# EAGLE schematic step_dance_wiring (EAGLE 9.6.2)
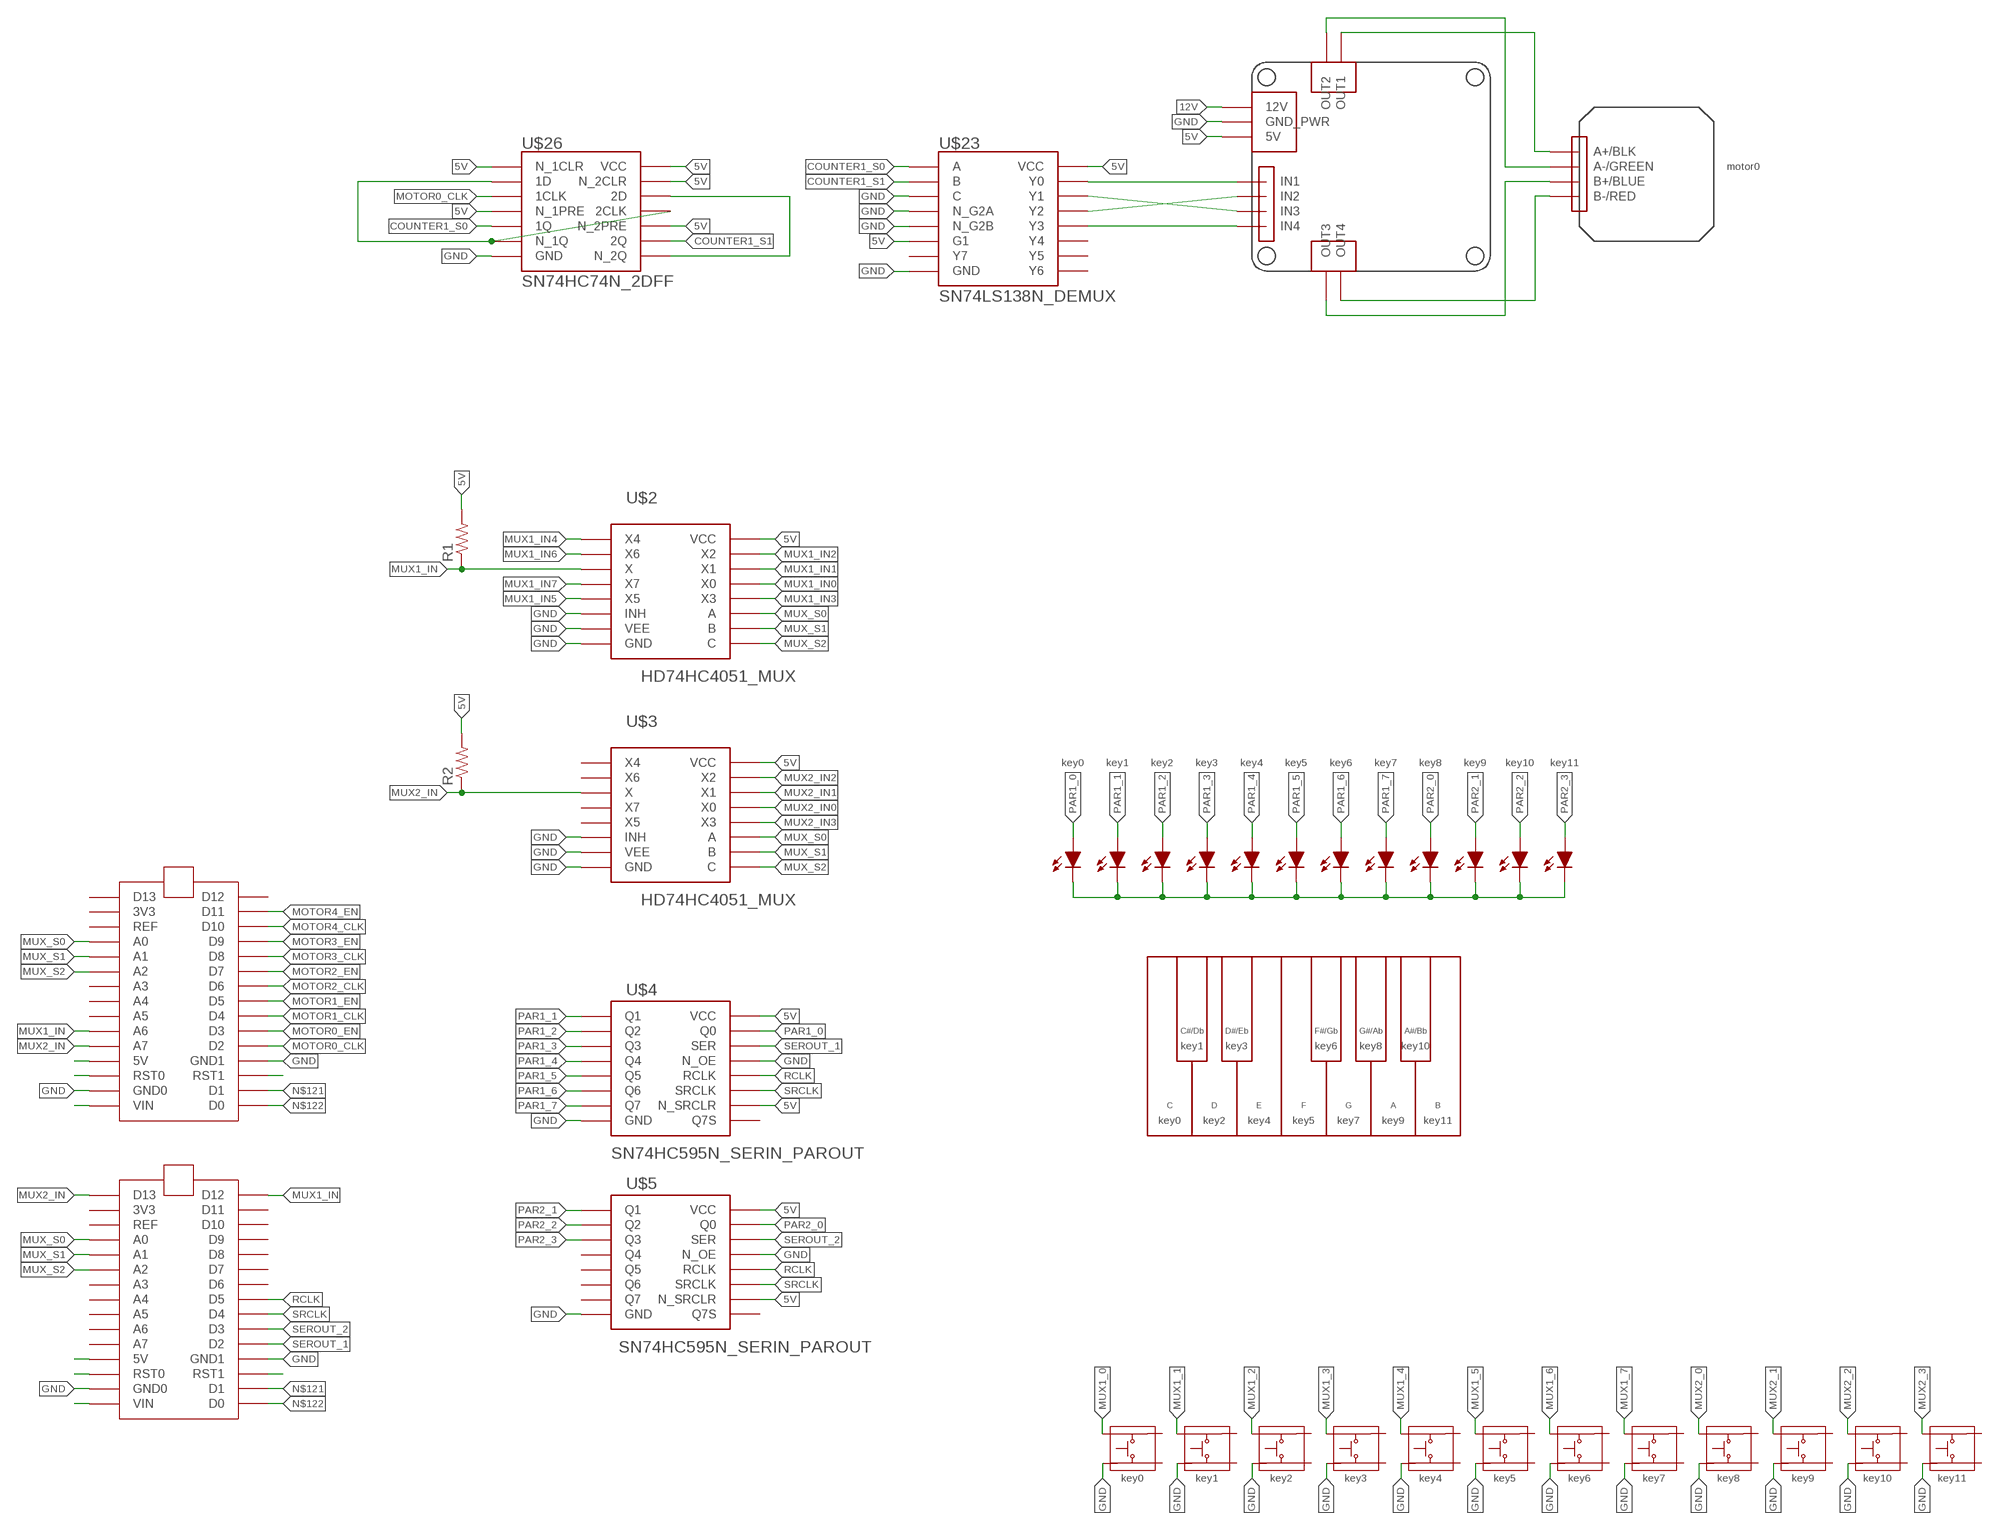
[diagram p0: schematic, sheet 1]

## Parts
LED1  LED-5MM  [LED-5MM]
LED2  LED-5MM  [LED-5MM]
LED3  LED-5MM  [LED-5MM]
LED4  LED-5MM  [LED-5MM]
LED5  LED-5MM  [LED-5MM]
LED6  LED-5MM  [LED-5MM]
LED7  LED-5MM  [LED-5MM]
LED8  LED-5MM  [LED-5MM]
LED9  LED-5MM  [LED-5MM]
LED10  LED-5MM  [LED-5MM]
LED11  LED-5MM  [LED-5MM]
LED12  LED-5MM  [LED-5MM]
R1  RES_AXIAL1/2W-0.5  [1/2W-0.5]
R2  RES_AXIAL1/2W-0.5  [1/2W-0.5]
U$1  ARDUNIO_NANO  [PINS]
U$2  HD74HC4051_MUX  [PINS]
U$3  HD74HC4051_MUX  [PINS]
U$4  SN74HC595N_SERIN_PAROUT  [PINS]
U$5  SN74HC595N_SERIN_PAROUT  [PINS]
U$7  MOTOR_DRIVER_HILETGO  [PINS]
U$8  STEPPER  [PINS]
U$9  KEYBOARD  [PINS]
U$10  PUSHBUTTON  [PINS]
U$11  PUSHBUTTON  [PINS]
U$12  PUSHBUTTON  [PINS]
U$13  PUSHBUTTON  [PINS]
U$14  PUSHBUTTON  [PINS]
U$15  PUSHBUTTON  [PINS]
U$16  PUSHBUTTON  [PINS]
U$17  PUSHBUTTON  [PINS]
U$18  PUSHBUTTON  [PINS]
U$19  PUSHBUTTON  [PINS]
U$20  PUSHBUTTON  [PINS]
U$21  PUSHBUTTON  [PINS]
U$22  ARDUNIO_NANO  [PINS]
U$23  SN74LS138N_DEMUX  [PINS]
U$26  SN74HC74N_2DFF  [PINS]

## Nets
5V: R1.2 R2.2 U$2.P$6(VCC) U$3.P$6(VCC) U$4.P$3(N_SRCLR) U$4.P$16(VCC) U$5.P$3(N_SRCLR) U$5.P$16(VCC) U$7.P$1(5V) U$23.P$4(G1) U$23.P$8(VCC) U$26.P$8(N_1CLR) U$26.P$9(N_1PRE) U$26.P$11(N_2CLR) U$26.P$12(N_2PRE) U$26.P$14(VCC)
12V: U$7.P$2(12V)
COUNTER1_S0: U$23.P$1(A) U$26.P$3(1Q)
COUNTER1_S1: U$23.P$2(B) U$26.P$6(2Q)
GND: U$1.P$25(GND0) U$1.P$26(GND1) U$2.P$4(GND) U$2.P$5(INH) U$2.P$7(VEE) U$3.P$4(GND) U$3.P$5(INH) U$3.P$7(VEE) U$4.P$2(GND) U$4.P$4(N_OE) U$5.P$2(GND) U$5.P$4(N_OE) U$7.P$3(GND_PWR) U$10.P$2 U$11.P$2 U$12.P$2 U$13.P$2 U$14.P$2 U$15.P$2 U$16.P$2 U$17.P$2 U$18.P$2 U$19.P$2 U$20.P$2 U$21.P$2 U$22.P$25(GND0) U$22.P$26(GND1) U$23.P$3(C) U$23.P$5(GND) U$23.P$6(N_G2A) U$23.P$7(N_G2B) U$26.P$7(GND)
MOTOR0_CLK: U$1.P$13(D2) U$26.P$1(1CLK)
MOTOR0_EN: U$1.P$14(D3)
MOTOR1_CLK: U$1.P$15(D4)
MOTOR1_EN: U$1.P$16(D5)
MOTOR2_CLK: U$1.P$17(D6)
MOTOR2_EN: U$1.P$18(D7)
MOTOR3_CLK: U$1.P$19(D8)
MOTOR3_EN: U$1.P$20(D9)
MOTOR4_CLK: U$1.P$21(D10)
MOTOR4_EN: U$1.P$22(D11)
MUX1_0: U$10.P$1
MUX1_1: U$11.P$1
MUX1_2: U$12.P$1
MUX1_3: U$13.P$1
MUX1_4: U$14.P$1
MUX1_5: U$15.P$1
MUX1_6: U$19.P$1
MUX1_7: U$20.P$1
MUX1_IN: R1.1 U$1.P$9(A6) U$2.P$8(X) U$22.P$23(D12)
MUX1_IN0: U$2.P$9(X0)
MUX1_IN1: U$2.P$10(X1)
MUX1_IN2: U$2.P$11(X2)
MUX1_IN3: U$2.P$12(X3)
MUX1_IN4: U$2.P$13(X4)
MUX1_IN5: U$2.P$14(X5)
MUX1_IN6: U$2.P$15(X6)
MUX1_IN7: U$2.P$16(X7)
MUX2_0: U$21.P$1
MUX2_1: U$16.P$1
MUX2_2: U$17.P$1
MUX2_3: U$18.P$1
MUX2_IN: R2.1 U$1.P$10(A7) U$3.P$8(X) U$22.P$24(D13)
MUX2_IN0: U$3.P$9(X0)
MUX2_IN1: U$3.P$10(X1)
MUX2_IN2: U$3.P$11(X2)
MUX2_IN3: U$3.P$12(X3)
MUX_S0: U$1.P$3(A0) U$2.P$1(A) U$3.P$1(A) U$22.P$3(A0)
MUX_S1: U$1.P$4(A1) U$2.P$2(B) U$3.P$2(B) U$22.P$4(A1)
MUX_S2: U$1.P$5(A2) U$2.P$3(C) U$3.P$3(C) U$22.P$5(A2)
N$1: U$7.P$5(IN2) U$23.P$11(Y2)
N$2: U$7.P$6(IN3) U$23.P$10(Y1)
N$3: U$26.P$5(2D) U$26.P$13(N_2Q)
N$4: U$26.P$2(1D) U$26.P$4(2CLK) U$26.P$10(N_1Q)
N$5: U$22.P$2(5V)
N$6: U$22.P$28(RST0)
N$7: U$22.P$30(VIN)
N$8: U$7.P$8(OUT1) U$8.P$1(A+/BLK)
N$9: U$7.P$9(OUT2) U$8.P$2(A-/GREEN)
N$10: U$7.P$10(OUT3) U$8.P$3(B+/BLUE)
N$11: U$7.P$11(OUT4) U$8.P$4(B-/RED)
N$12: U$22.P$29(RST1)
N$18: LED1.K(C) LED2.K(C) LED3.K(C) LED4.K(C) LED5.K(C) LED6.K(C) LED7.K(C) LED8.K(C) LED9.K(C) LED10.K(C) LED11.K(C) LED12.K(C)
N$63: U$7.P$7(IN4) U$23.P$12(Y3)
N$66: U$7.P$4(IN1) U$23.P$9(Y0)
N$111: U$1.P$2(5V)
N$112: U$1.P$28(RST0)
N$114: U$1.P$30(VIN)
N$120: U$1.P$29(RST1)
N$121: U$1.P$12(D1) U$22.P$12(D1)
N$122: U$1.P$11(D0) U$22.P$11(D0)
PAR1_0: LED1.A U$4.P$5(Q0)
PAR1_1: LED2.A U$4.P$6(Q1)
PAR1_2: LED3.A U$4.P$7(Q2)
PAR1_3: LED4.A U$4.P$8(Q3)
PAR1_4: LED5.A U$4.P$9(Q4)
PAR1_5: LED6.A U$4.P$10(Q5)
PAR1_6: LED7.A U$4.P$11(Q6)
PAR1_7: LED8.A U$4.P$12(Q7)
PAR2_0: LED9.A U$5.P$5(Q0)
PAR2_1: LED10.A U$5.P$6(Q1)
PAR2_2: LED11.A U$5.P$7(Q2)
PAR2_3: LED12.A U$5.P$8(Q3)
RCLK: U$4.P$15(RCLK) U$5.P$15(RCLK) U$22.P$16(D5)
SEROUT_1: U$4.P$1(SER) U$22.P$13(D2)
SEROUT_2: U$5.P$1(SER) U$22.P$14(D3)
SRCLK: U$4.P$14(SRCLK) U$5.P$14(SRCLK) U$22.P$15(D4)
Unconnected: U$1.P$1(3V3) U$1.P$6(A3) U$1.P$7(A4) U$1.P$8(A5) U$1.P$23(D12) U$1.P$24(D13) U$1.P$27(REF) U$3.P$13(X4) U$3.P$14(X5) U$3.P$15(X6) U$3.P$16(X7) U$4.P$13(Q7S) U$5.P$9(Q4) U$5.P$10(Q5) U$5.P$11(Q6) U$5.P$12(Q7) U$5.P$13(Q7S) U$10.P$3 U$10.P$4 U$11.P$3 U$11.P$4 U$12.P$3 U$12.P$4 U$13.P$3 U$13.P$4 U$14.P$3 U$14.P$4 U$15.P$3 U$15.P$4 U$16.P$3 U$16.P$4 U$17.P$3 U$17.P$4 U$18.P$3 U$18.P$4 U$19.P$3 U$19.P$4 U$20.P$3 U$20.P$4 U$21.P$3 U$21.P$4 U$22.P$1(3V3) U$22.P$6(A3) U$22.P$7(A4) U$22.P$8(A5) U$22.P$9(A6) U$22.P$10(A7) U$22.P$17(D6) U$22.P$18(D7) U$22.P$19(D8) U$22.P$20(D9) U$22.P$21(D10) U$22.P$22(D11) U$22.P$27(REF) U$23.P$13(Y4) U$23.P$14(Y5) U$23.P$15(Y6) U$23.P$16(Y7)

## Notes on the sheet
- motor0
- key0 | key1 | key2 | key3 | key4 | key5 | key6 | key7 | key8 | key9 | key10 | key11
- C#/Db | D#/Eb | F#/Gb | G#/Ab | A#/Bb
- key1 | key3 | key6 | key8 | key10
- C | D | E | F | G | A | B
- key0 | key2 | key4 | key5 | key7 | key9 | key11
- key0 | key1 | key2 | key3 | key4 | key5 | key6 | key7 | key8 | key9 | key10 | key11

## Library data of the parts
LED1-LED12 = GTOR - Passive Components:LED: Light Emitting Diode (LED) Source: Dangerous Prototypes Eagle Library <https://github.com/DangerousPrototypes/Eagle_Part_Library>
R1 R2 = GTOR - Passive Components:RES_AXIAL: RESISTOR, American symbol; SPICEPREFIX: R
U$1 U$22 = StepDance:ARDUNIO_NANO
U$2 U$3 = StepDance:HD74HC4051_MUX
U$4 U$5 = StepDance:SN74HC595N_SERIN_PAROUT
U$7 = StepDance:MOTOR_DRIVER_HILETGO
U$8 = StepDance:STEPPER
U$9 = StepDance:KEYBOARD
U$10-U$21 = StepDance:PUSHBUTTON
U$23 = StepDance:SN74LS138N_DEMUX
U$26 = StepDance:SN74HC74N_2DFF